# Altium project Station-Link.PrjPcb
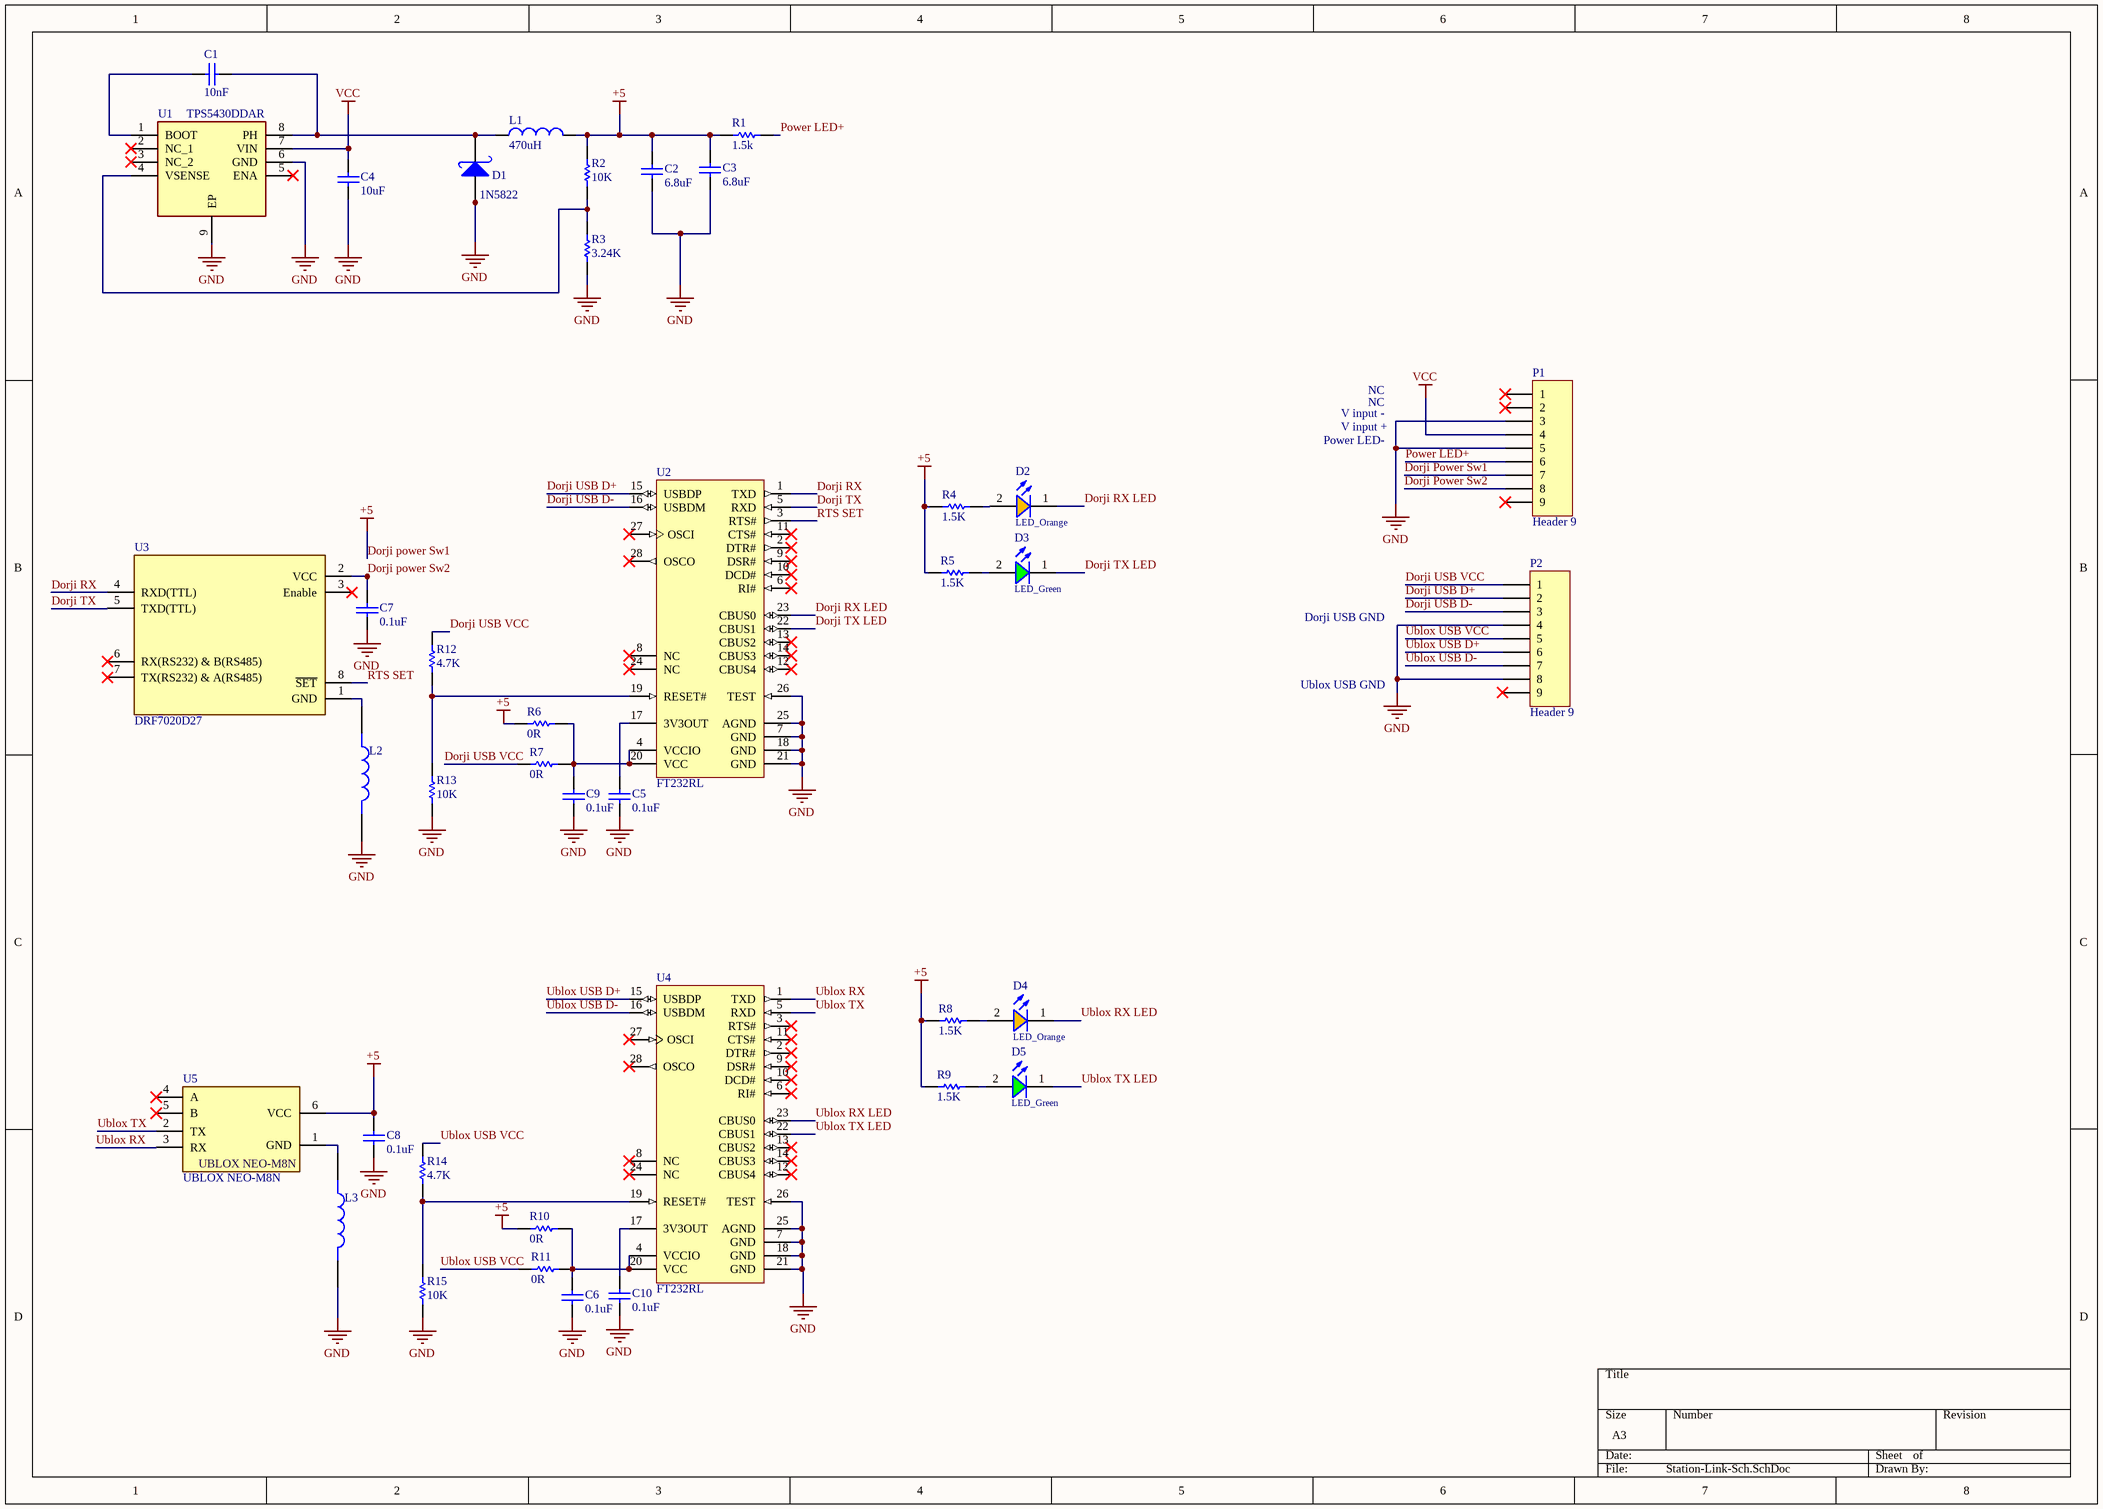
[diagram p0: Station-Link-Sch.SchDoc]
1 sheet, 40 parts. Net scope: global (net labels, ports and power ports of the same name join across sheets).
Board file: Station-Link.PcbDoc

## Sheet Station-Link-Sch.SchDoc
size A3; SheetNumber: 1; SheetTotal: 1

### Parts
C1  10nF  [C0805]
C2  6.8uF  [C0805]
C3  6.8uF  [C0805]
C4  10uF  [C0805]
C5  0.1uF  [C0805]
C6  0.1uF  [C0805]
C7  0.1uF  [C0805]
C8  0.1uF  [C0805]
C9  0.1uF  [C0805]
C10  0.1uF  [C0805]
D1  1N5822  [D_SMA_214AC]
D2  LED_Orange  [LED_0805]
D3  LED_Green  [LED_0805]
D4  LED_Orange  [LED_0805]
D5  LED_Green  [LED_0805]
L1  470uH  [RH127_L_12*12*8]
L2  HZ0805G471R-10  [IND_HZ0805G471R-10]  (value not drawn)
L3  HZ0805G471R-10  [IND_HZ0805G471R-10]  (value not drawn)
P1  Header 9  [Header 9]
P2  Header 9  [Header 9]
R1  1.5k  [R0805]
R2  10K  [R0805]
R3  3.24K  [R0805]
R4  1.5K  [R0805]
R5  1.5K  [R0805]
R6  0R  [R0805]
R7  0R  [R0805]
R8  1.5K  [R0805]
R9  1.5K  [R0805]
R10  0R  [R0805]
R11  0R  [R0805]
R12  4.7K  [R0805]
R13  10K  [R0805]
R14  4.7K  [R0805]
R15  10K  [R0805]
U1  TPS5430DDAR  [SOIC8E]
U2  FT232RL  [FTDI-SSOP-28_M]
U3  DRF7020D27  [DRF7020D27]
U4  FT232RL  [FTDI-SSOP-28_M]
U5  UBLOX NEO-M8N  [UBLOX NEO-M8N - customized]

### Nets
Dorji power Sw1: C2.2 C3.2 C8.2 L1.2 P1.7 R1.2 R2.2 R4.1 R5.1 R6.2 R8.1 R9.1 R10.2 U5.6(VCC)  [also labelled +5]
GND: C2.1 C3.1 C4.2 C5.1 C6.1 C7.1 C8.1 C9.1 C10.1 D1.1(A) L2.2 L3.2 P1.3 P1.5 P2.4 P2.8 R3.1 R13.2 R15.2 U1.6(GND) U1.9(EP) U2.7(GND) U2.18(GND) U2.21(GND) U2.25(AGND) U2.26(TEST) U4.7(GND) U4.18(GND) U4.21(GND) U4.25(AGND) U4.26(TEST)
VCC: C4.1 P1.4 U1.7(VIN)
Dorji power Sw2: C7.2 P1.8 U3.2(VCC)
Dorji RX: U2.1(TXD) U3.4(RXD(TTL))
Dorji RX LED: D2.1(K) U2.23(CBUS0)
Dorji TX: U2.5(RXD) U3.5(TXD(TTL))
Dorji TX LED: D3.1(K) U2.22(CBUS1)
Dorji USB D+: P2.2 U2.15(USBDP)
Dorji USB D-: P2.3 U2.16(USBDM)
Dorji USB VCC: P2.1 R7.1 R12.1
Power LED+: P1.6 R1.1
RTS SET: U2.3(RTS#) U3.8(~{SET})
Ublox RX: U4.1(TXD) U5.3(RX)
Ublox RX LED: D4.1(K) U4.23(CBUS0)
Ublox TX: U4.5(RXD) U5.2(TX)
Ublox TX LED: D5.1(K) U4.22(CBUS1)
Ublox USB D+: P2.6 U4.15(USBDP)
Ublox USB D-: P2.7 U4.16(USBDM)
Ublox USB VCC: P2.5 R11.1 R14.1
NetC1_1: C1.1 D1.2(K) L1.1 U1.8(PH)
NetC1_2: C1.2 U1.1(BOOT)
NetC5_2: C5.2 U2.17(3V3OUT)
NetC6_2: C6.2 R10.1 R11.2 U4.4(VCCIO) U4.20(VCC)
NetC9_2: C9.2 R6.1 R7.2 U2.4(VCCIO) U2.20(VCC)
NetC10_2: C10.2 U4.17(3V3OUT)
NetD2_2: D2.2(A) R4.2
NetD3_2: D3.2(A) R5.2
NetD4_2: D4.2(A) R8.2
NetD5_2: D5.2(A) R9.2
NetL2_1: L2.1 U3.1(GND)
NetL3_1: L3.1 U5.1(GND)
NetR2_1: R2.1 R3.2 U1.4(VSENSE)
NetR12_2: R12.2 R13.1 U2.19(RESET#)
NetR14_2: R14.2 R15.1 U4.19(RESET#)

Not connected (* = marked no-connect by the designer): P1 1* 2* 9*; P2 9*; U1 2(NC_1)* 3(NC_2)* 5(ENA)*; U2 2(DTR#)* 6(RI#)* 8(NC)* 9(DSR#)* 10(DCD#)* 11(CTS#)* 12(CBUS4)* 13(CBUS2)* 14(CBUS3)* 24(NC)* 27(OSCI)* 28(OSCO)*; U3 3(Enable)* 6(RX(RS232)_&_B(RS485))* 7(TX(RS232)_&_A(RS485))*; U4 2(DTR#)* 3(RTS#)* 6(RI#)* 8(NC)* 9(DSR#)* 10(DCD#)* 11(CTS#)* 12(CBUS4)* 13(CBUS2)* 14(CBUS3)* 24(NC)* 27(OSCI)* 28(OSCO)*; U5 4(A)* 5(B)*

### Notes on the sheet
- Power LED-
- V input -
- V input +
- NC
- Dorji USB GND
- Ublox USB GND

### Library data of the parts
C1-C10 = CAP SMD 0805: CAP 0805; Designer: Abbas Basereh; BHK_Group: Capacitor; BHK_SUB_Group: C_805; BHK_NC: no; Desc.: CAP SMD 0805; Data: 16-12-2016
  C1: BHK_Name: 10nF
  C2 C3: BHK_Name: 6.8uF
  C4: BHK_Name: 10uF
  C5-C10: BHK_Name: 0.1uF
D1 = 1N5819 SMD: Schottky Rectifiers; Part. No: SS34; Manufacturer: ON Semiconductor/Fairchild; Designer: Abbas Basereh; BHK_SUB_Group: Shotcky; BHK_Name: 1N5819; BHK_Group: Diod; BHK_NC: no; Link: https://www.aliexpress.com/item/Free-shipping-100pcs-1n5822-sma-smd-do-214ac-Schottky-diode-ss34/32337482329.html?spm=2114.01010208.3.1.zLZDsP&ws_ab_test=searchweb0_0,searchweb201602_4_10065_10068_10084_10083_10080_10082_10081_10060_10061_10062_10056_10055_10054_10059_10099_10078_10079_427_10073_10103_10102_10096_10052_10050_10051,searchweb201603_4&btsid=6e50dc92-ac69-45bc-a19e-209af19ce602; Link: http://www.tme.eu/en/details/ss34/smd-schottky-diodes/vishay/ss34-e357t/; Link: http://www.digikey.com/product-detail/en/on-semiconductor-fairchild/SS34/SS34FSCT-ND/2094459; Data: 16-12-2016
D2 D4 = LED 0805 Orange: SMT Mono-color Chip LED Waterclear WL-SMCW, size 0805, Amber, 2 V, 140 deg, 130 mcd; Part Number: 150080AS75000; Forward Voltage: 2 V; Viewing Angle: 140 deg; Peak Wavelength: 610 nm; Dominant Wavelength: 605 nm; Luminous Intensity: 130 mcd; Chip Technology: AlInGaP; BHK_Group: Public_PCB; BHK_Name: Orange; BHK_SUB_Group: LED_805; BHK_NC: no; ComponentLink1Description: Manufacturer; ComponentLink1URL: http://www.we-online.de; ComponentLink2Description: Datasheet; ComponentLink2URL: https://katalog.we-online.de/led/datasheet/150080AS75000.pdf; Published Date: November 2018; Publisher: Wurth Elektronik; Size: 0805; Operating Temperature: -40 to 85 degC; Emitting Color: Amber; Mounting Technology: SMT; Packaging: Tape and Reel
D3 D5 = LED 0805 Green: SMT Mono-color Chip LED Waterclear WL-SMCW, size 0805, Green, 3.2 V, 140 deg, 450 mcd; Part Number: 150080GS75000; Forward Voltage: 3.2 V; Viewing Angle: 140 deg; Peak Wavelength: 515 nm; Dominant Wavelength: 525 nm; Luminous Intensity: 450 mcd; Chip Technology: InGaN; BHK_Group: Public_PCB; BHK_SUB_Group: LED_805; BHK_NC: no; ComponentLink1Description: Manufacturer; ComponentLink1URL: http://www.we-online.de; ComponentLink2Description: Datasheet; ComponentLink2URL: https://katalog.we-online.de/led/datasheet/150080GS75000.pdf; Published Date: November 2018; Publisher: Wurth Elektronik; Size: 0805; Operating Temperature: -40 to 85 degC; Emitting Color: Green; Mounting Technology: SMT; Packaging: Tape and Reel; BHK_Name: Green
L1 = Inductor: Code_IEC: 1005; BHK_SUB_Group: Other_Self; BHK_Group: Self; BHK_Name: 33UH; BHK_NC: no; Published: 8-Jun-2000; LatestRevisionDate: 29-May-2009; LatestRevisionNote: IPC-7351 Footprint Added.; PackageReference: 0402-A; Publisher: Altium Limited; PackageDescription: Chip Inductor; Code_JEITA: 0402
L2 L3 = HZ0805G471R-10: 470 Ohms @ 100 MHz 1 Power, Signal Line Ferrite Bead 0805 (2012 Metric) 1A 200mOhm; MF: Laird-Signal Integrity; SnapEDA_Link: https://www.snapeda.com/parts/HZ0805G471R-10/Laird-Signal+Integrity+Products/view-part/?ref=snap; Package: 0805 Laird; Value: *; MP: HZ0805G471R-10; Check_prices: https://www.snapeda.com/parts/HZ0805G471R-10/Laird-Signal+Integrity+Products/view-part/?ref=eda
R1-R15 = RES 0805: Resistor; Designer: Abbas Basereh; Desc.: RES SMD 0805; BHK_SUB_Group: R_805; BHK_NC: no; Data: 16-12-2016; BHK_Group: Resistor
  R1: BHK_Name: 1.5k
  R2 R13 R15: BHK_Name: 10K
  R3: BHK_Name: 3.24K
  R4 R5 R8 R9: BHK_Name: 1.5K
  R6 R7 R10 R11: BHK_Name: 0R
  R12 R14: BHK_Name: 4.7K
U1 = TPS5430DDAR: Texas Instruments, TPS5430DDAR Step-Down Switching Regulator 3A Adjustable, 1.22  31 V, 8-Pin SOIC; Geometry.Height: 1.7mm; BHK_Group: IC; BHK_NC: No; Manufacturer_Name: Texas Instruments; Manufacturer_Part_Number: TPS5430DDAR; Mouser Part Number: 595-TPS5430DDAR; Mouser Price/Stock: https://www.mouser.co.uk/ProductDetail/Texas-Instruments/TPS5430DDAR?qs=zwk82MlA57ZJdOTovH1aYA%3D%3D; Arrow Part Number: TPS5430DDAR; Arrow Price/Stock: https://www.arrow.com/en/products/tps5430ddar/texas-instruments?region=nac; Datasheet Link: http://www.ti.com/lit/gpn/tps5430; BHK_SUB_Group: Regulator; BHK_Name: TPS5430DDAR
U2 U4 = CMP-2000-05029-1: IC USB FS SERIAL UART 28-SSOP; Manufacturer: FTDI; Receive FIFO: 256B; Number of Channels per Chip: 1; Maximum Data Rate: 3MBd; Transmit FIFO: 128B; Dimensions: 10.2x5.3x1.75mm; Mounting Type: SurfaceMount; Height: 1.75mm; Package Type: SSOP; Datasheet Version: Rev. 1.04, 02/2006; Width: 5.3mm; Manufacturer URL: http://www.ftdichip.com/; Datasheet URL: http://datasheet.octopart.com/FT232RL-FTDI-datasheet-120501.pdf; Maximum Operating Temperature: +85degC; Minimum Operating Temperature: -40degC; Pin Count: 28; Length: 10.2mm
U3 = DRF7020D27: DRF7020D27 is a low-cost sub-1 GHz transceiver module; BHK_SUB_Group: RF; BHK_NC: NO; BHK_Group: Module; BHK_Name: DRF7020D27
U5 = UBLOX NEO-M8N_customized: BHK_Group: Module; BHK_SUB_Group: GPS; BHK_NC: NO; BHK_Name: UBLOX NEO-M8N